# Altium schematic sheet Generic_Display.SchDoc: Evaluation Board 3.2
size A3; Organization: Toradex AG; Address1: Altsagenstrasse 5; Address2: Horw; Address3: 6048; Address4: Switzerland; DocumentNumber: 15; Revision: V3.2; SheetNumber: 15; SheetTotal: 23; PageSetup: Record=PageOptions|CenterHorizontal=True|CenterVertical=True|PrintScale=0.73|XCorrection=1.00|YCorrection=1.00|PrintKind=0|BorderSize=5000000|LeftOffset=0|BottomOffset=0|Orientation=2|PaperLength=1000|PaperWidth=1000|Scale=100|PaperSource=7|PrintQuality=-4|MediaType=1|DitherType=10|PaperKind=A4|PrintScaleMode=1
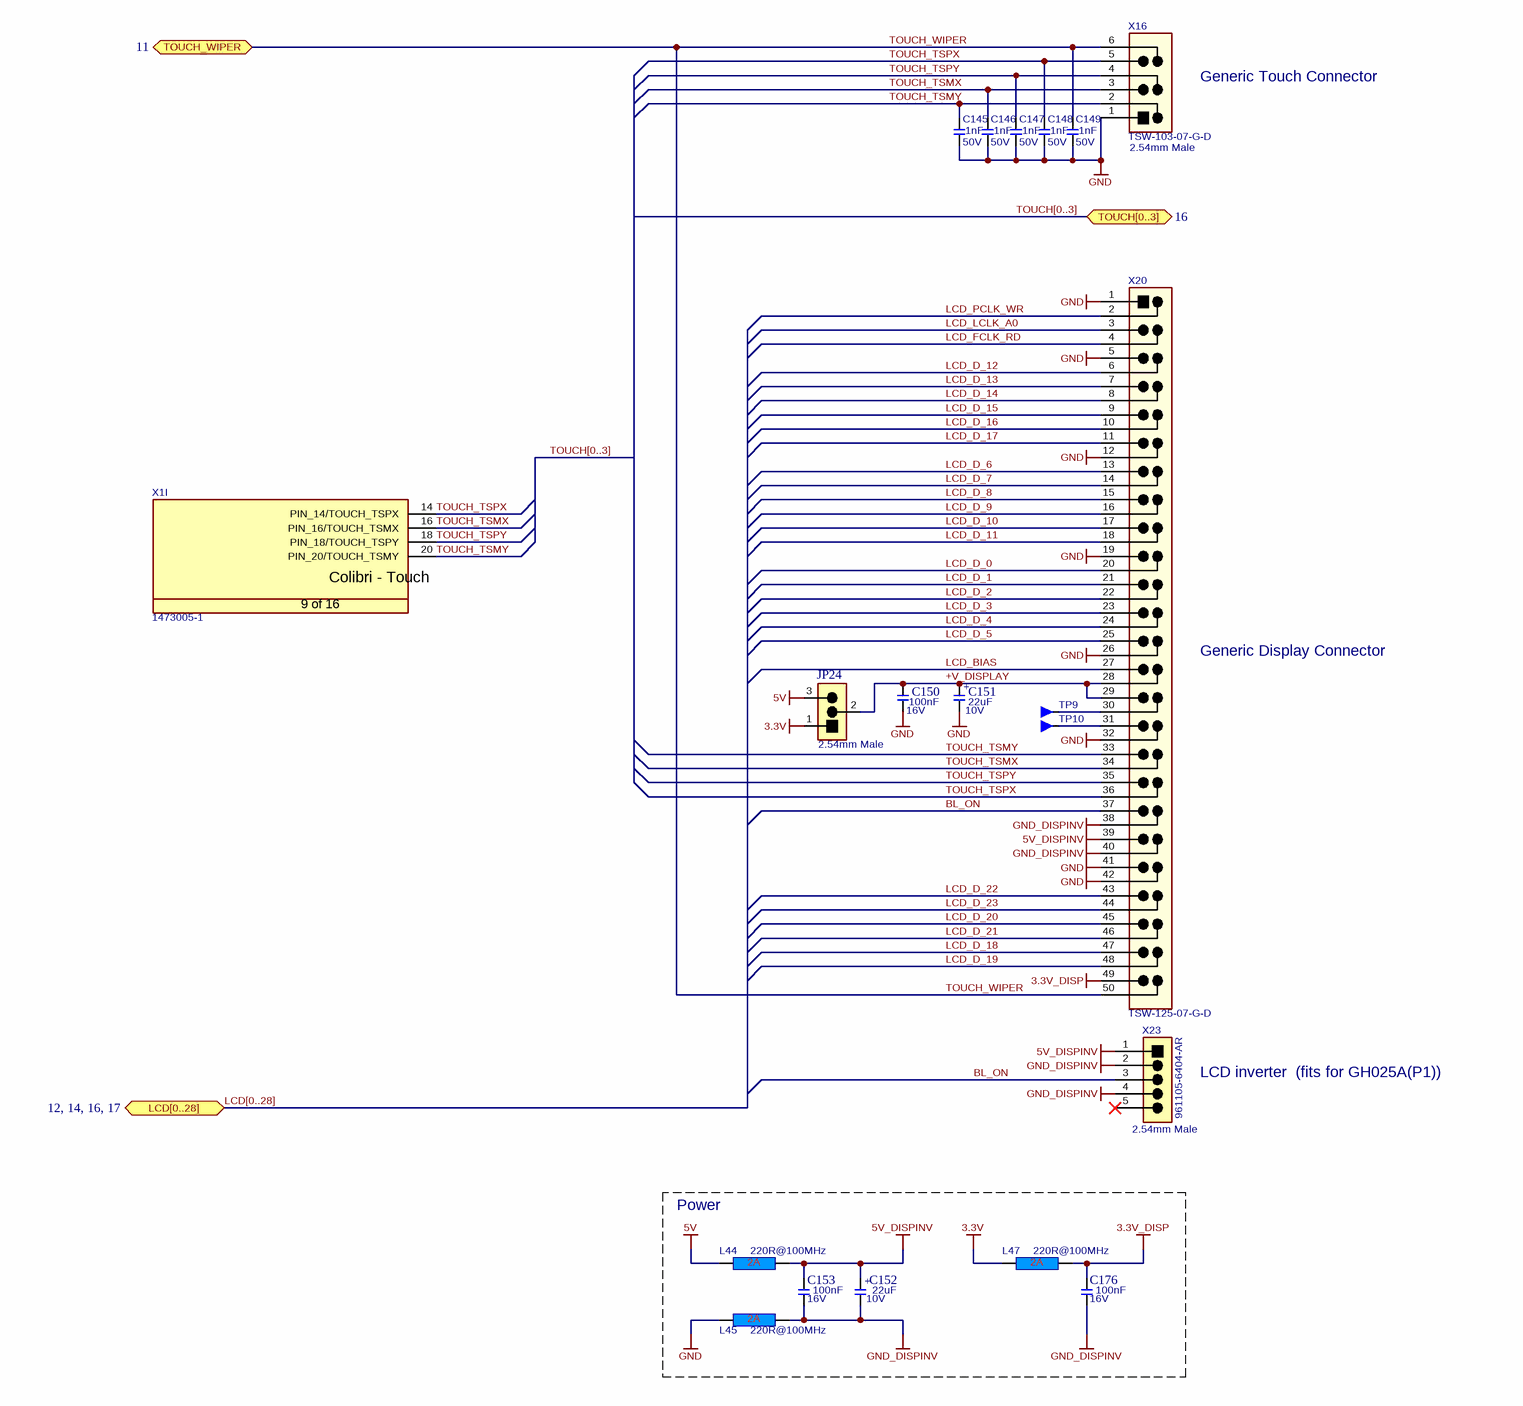
[diagram p0: Generic_Display.SchDoc]

## Parts
C145  Rating: 50V  [T_CAPC0603X33N]  (hidden comment: 1nF)
C146  Rating: 50V  [T_CAPC0603X33N]  (hidden comment: 1nF)
C147  Rating: 50V  [T_CAPC0603X33N]  (hidden comment: 1nF)
C148  Rating: 50V  [T_CAPC0603X33N]  (hidden comment: 1nF)
C149  Rating: 50V  [T_CAPC0603X33N]  (hidden comment: 1nF)
C150  Rating: 16V  [T_CAPC0603X33N]  (hidden comment: 100nF)
C151  Rating: 10V  [CAPMP3528X210N]  (hidden comment: 22uF)
C152  Rating: 10V  [CAPMP3528X210N]  (hidden comment: 22uF)
C153  Rating: 16V  [T_CAPC0603X33N]  (hidden comment: 100nF)
C176  Rating: 16V  [T_CAPC0603X33N]  (hidden comment: 100nF)
JP24  826936-3  [T_TYCO_826936-3]  (value not drawn)
L44  220R@100MHz  [INDC1608X95N]
L45  220R@100MHz  [INDC1608X95N]
L47  220R@100MHz  [INDC1608X95N]
TP9  Testpin  [T_TP-THT]  (value not drawn)
TP10  Testpin  [T_TP-THT]  (value not drawn)
X1  Manufacturer Part No.: 1473005-1  [T_Tyco_1473005-1]  (hidden comment: CON-Tyco-1473005-1-200-0.6mm)  (part I of 16)
X16  TSW-103-07-G-D  [T_Samtec_TSW-103-07-G-D]
X20  TSW-125-07-G-D  [T_SAMTEC_TSW-125-07-G-D]
X23  961105-6404-AR  [T_3M_961105-6404-AR]

## Blocks framed on the sheet
Power: C152 C153 C176 L44 L45 L47

## Ports
LCD[0..28] (bidir, see 12, 14, 16, 17), TOUCH[0..3] (bidir, see 16), TOUCH_WIPER (bidir, see 11)

## Nets
3.3V: JP24.1 L47.1
3.3V_DISP: C176.2 L47.2 X20.49
5V: JP24.3 L44.1
5V_DISPINV: C152.1 C153.2 L44.2 X20.39 X23.1
GND: C145.1 C146.1 C147.1 C148.1 C149.1 C150.1 C151.2 L45.1 X16.1 X20.1 X20.5 X20.12 X20.19 X20.26 X20.32 X20.41 X20.42
GND_DISPINV: C152.2 C153.1 C176.1 L45.2 X20.38 X20.40 X23.2 X23.4
+V_DISPLAY: C150.2 C151.1 JP24.2 X20.28 X20.29
BL_ON: X20.37 X23.3
LCD_BIAS: X20.27
LCD_D_0: X20.20
LCD_D_1: X20.21
LCD_D_2: X20.22
LCD_D_3: X20.23
LCD_D_4: X20.24
LCD_D_5: X20.25
LCD_D_6: X20.13
LCD_D_7: X20.14
LCD_D_8: X20.15
LCD_D_9: X20.16
LCD_D_10: X20.17
LCD_D_11: X20.18
LCD_D_12: X20.6
LCD_D_13: X20.7
LCD_D_14: X20.8
LCD_D_15: X20.9
LCD_D_16: X20.10
LCD_D_17: X20.11
LCD_D_18: X20.47
LCD_D_19: X20.48
LCD_D_20: X20.45
LCD_D_21: X20.46
LCD_D_22: X20.43
LCD_D_23: X20.44
LCD_FCLK_RD: X20.4
LCD_LCLK_A0: X20.3
LCD_PCLK_WR: X20.2
TOUCH_TSMX: C146.2 X1.16(PIN_16/TOUCH_TSMX) X16.3 X20.34
TOUCH_TSMY: C145.2 X1.20(PIN_20/TOUCH_TSMY) X16.2 X20.33
TOUCH_TSPX: C148.2 X1.14(PIN_14/TOUCH_TSPX) X16.5 X20.36
TOUCH_TSPY: C147.2 X1.18(PIN_18/TOUCH_TSPY) X16.4 X20.35
TOUCH_WIPER: C149.2 X16.6 X20.50 ; port TOUCH_WIPER
NetTP9_1: TP9.1 X20.30
NetTP10_1: TP10.1 X20.31

Not connected (* = marked no-connect by the designer): X23 5*

## Buses and harness runs
bus LCD[0..28] = port LCD[0..28]
bus TOUCH[0..3] = port TOUCH[0..3]

## Notes on the sheet
- Generic Touch Connector
- (near X16) 2.54mm Male
- Generic Display Connector
- (near JP24) 2.54mm Male
- (near X23) LCD inverter  (fits for GH025A(P1))
- (near X23) 2.54mm Male
- Title
- Size:
- Date:
- A3
- Number:
- Time:
- Revision:
- Sheet
- of
- File:
- (in symbol C-TA-22uF-10V-20%-3528) +
- (in symbol CON-Tyco-1473005-1-200-0.6mm, part I) Colibri - Touch; 9 of 16

## Library data of the parts
C145-C149 = C-X7R-1nF-50V-10%-0603: Capacitor Ceramic X7R 1nF 50V 10% 0603; Tolerance: 10%; Type: X7R; Value: 1nF
C150 C153 C176 = C-X7R-100nF-16V-10%-0603: Capacitor Ceramic X7R 100nF 16V 10% 0603; Tolerance: 10%; Type: X7R; Value: 100nF
C151 C152 = C-TA-22uF-10V-20%-3528: Capacitor TA 22uF 10V 20% 3528; Tolerance: 20%; Type: TA; Value: 22uF
JP24 = CON-Tyco-826936-3-1X3-2.54mm-JP: Jumper, 3-Pin; Manufacturer Name: Tyco; No. of ways: 1X3; Pitch: 2.54mm; Manufacturer Part No.: 826936-3
L44 L45 L47 = L-220R@100MHz-2A-25%-0603: 220R@100MHz 2A EMI FILTER; Tolerance: 25%; Rating: 2A; Value: 220R@100MHz
TP9 TP10 = Testpin: Testpin TH
X1 = CON-Tyco-1473005-1-200-0.6mm: SODIMM Connector; Manufacturer Name: Tyco; No. of ways: 200
X16 = CON-Samtec-TSW-103-07-G-D: Header Male, 2x3 Pins, 2.54mm pitch; Manufacturer Name: Samtec; No. of. ways: 2x3; Pitch: 2.54mm; Manufacturer Part No.: TSW-103-07-G-D
X20 = CON-Samtec-TSW-125-07-G-D: Header, 2x25 Pins, 2.54 mm pitch; Manufacturer Name: Samtec; Pitch: 2.54mm; No. of ways: 2x25; Manufacturer Part No.: TSW-125-07-G-D
X23 = CON-3M-961105-6404-AR: Audio Header 5 pins 2.54mm; Manufacturer Name: 3M; No. of ways: 1X5; Pitch: 2.54mm; Manufacturer Part No.: 961105-6404-AR